# EAGLE design dnc_titreur (EAGLE 7.1.0)
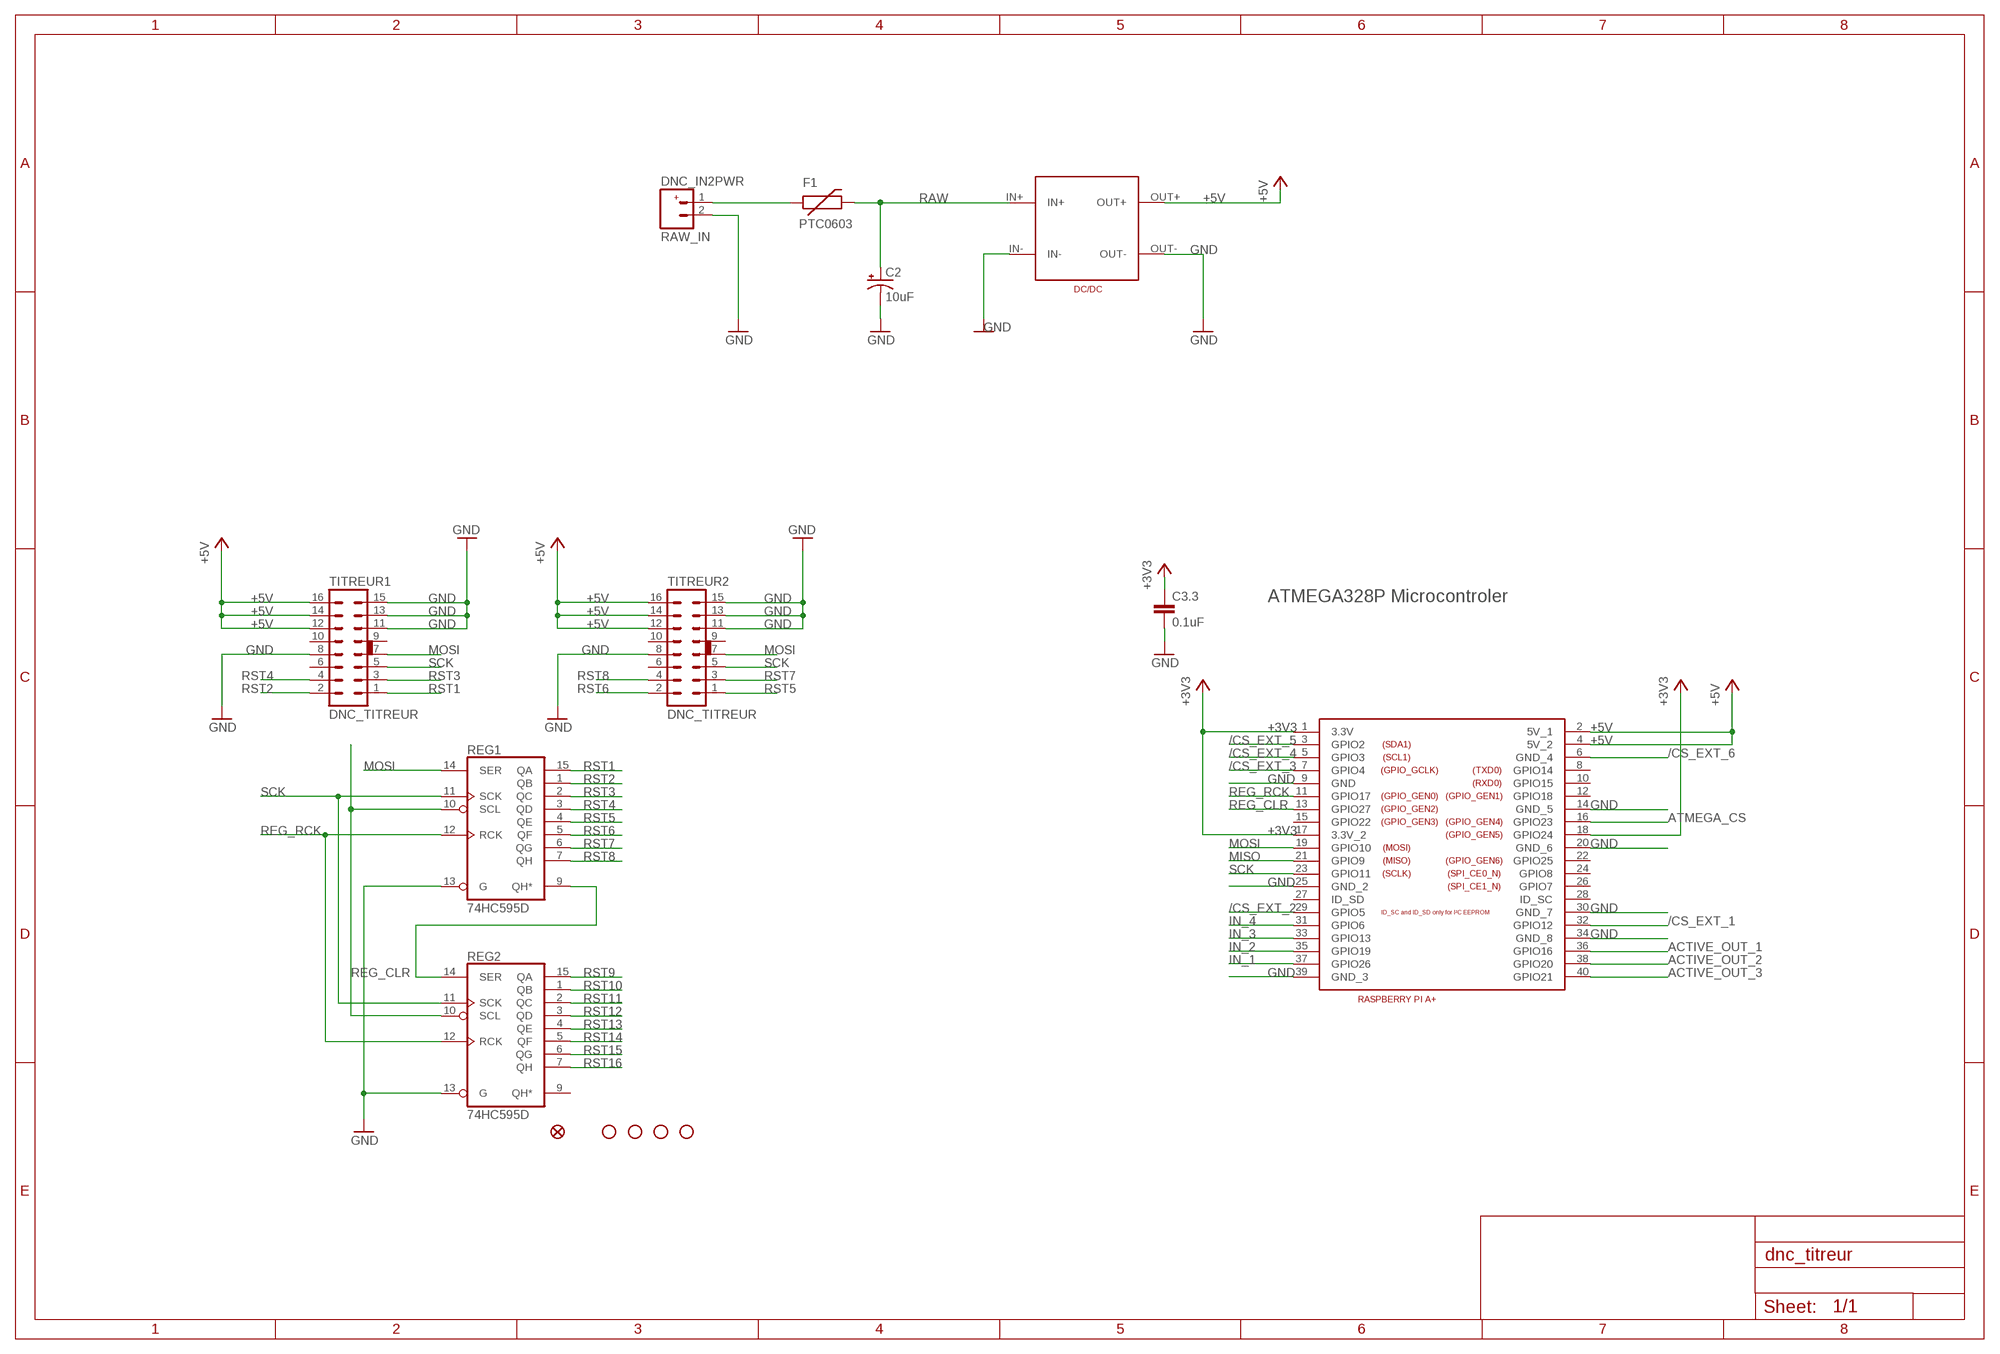
[diagram p0: schematic, sheet 1]

## Parts
C2  10uF  CAP_POL1206  [EIA3216]
C3.3  0.1uF  C-EUC0805  [C0805]
F1  PTC0603  [0603]
JP14  FIDUCIAL1X2.5  [FIDUCIAL-1X2.5]
JP15  STAND-OFF  [STAND-OFF]
JP16  STAND-OFF  [STAND-OFF]
JP17  STAND-OFF  [STAND-OFF]
JP18  STAND-OFF  [STAND-OFF]
RAW_IN  DNC_IN2PWR  [DNC_IN2_PWR]
REG1  74HC595D  [SO16]
REG2  74HC595D  [SO16]
TITREUR1  DNC_TITREUR  [DNC_TITREUR]
TITREUR2  DNC_TITREUR  [DNC_TITREUR]
U$4  RASPIA+  [RASPIA+]
U$5  DC/DC_SEED  [DC/DC_SEED]

## Nets
+3V3: C3.3.1 U$4.1(3.3V) U$4.17(3.3V_2) U$4.18(GPIO24)
+5V: TITREUR1.12 TITREUR1.14 TITREUR1.16 TITREUR2.12 TITREUR2.14 TITREUR2.16 U$4.2(5V_1) U$4.4(5V_2) U$5.OUT+
/CS_EXT_1: U$4.32(GPIO12)
/CS_EXT_2: U$4.29(GPIO5)
/CS_EXT_3: U$4.7(GPIO4)
/CS_EXT_4: U$4.5(GPIO3)
/CS_EXT_5: U$4.3(GPIO2)
/CS_EXT_6: U$4.6(GND_4)
ACTIVE_OUT_1: U$4.36(GPIO16)
ACTIVE_OUT_2: U$4.38(GPIO20)
ACTIVE_OUT_3: U$4.40(GPIO21)
ATMEGA_CS: U$4.16(GPIO23)
GND: C2.C(-) C3.3.2 RAW_IN.2 REG1.13(G) REG2.13(G) TITREUR1.8 TITREUR1.11 TITREUR1.13 TITREUR1.15 TITREUR2.8 TITREUR2.11 TITREUR2.13 TITREUR2.15 U$4.9(GND) U$4.14(GND_5) U$4.20(GND_6) U$4.25(GND_2) U$4.30(GND_7) U$4.34(GND_8) U$4.39(GND_3) U$5.IN- U$5.OUT-
IN_1: U$4.37(GPIO26)
IN_2: U$4.35(GPIO19)
IN_3: U$4.33(GPIO13)
IN_4: U$4.31(GPIO6)
MISO: U$4.21(GPIO9)
MOSI: REG1.14(SER) TITREUR1.7 TITREUR2.7 U$4.19(GPIO10)
N$7: REG1.9(QH*) REG2.14(SER)
N$12: F1.1 RAW_IN.1
RAW: C2.A(+) F1.2 U$5.IN+
REG_CLR: REG1.10(SCL) REG2.10(SCL) U$4.13(GPIO27)
REG_RCK: REG1.12(RCK) REG2.12(RCK) U$4.11(GPIO17)
RST1: REG1.15(QA) TITREUR1.1
RST2: REG1.1(QB) TITREUR1.2
RST3: REG1.2(QC) TITREUR1.3
RST4: REG1.3(QD) TITREUR1.4
RST5: REG1.4(QE) TITREUR2.1
RST6: REG1.5(QF) TITREUR2.2
RST7: REG1.6(QG) TITREUR2.3
RST8: REG1.7(QH) TITREUR2.4
RST9: REG2.15(QA)
RST10: REG2.1(QB)
RST11: REG2.2(QC)
RST12: REG2.3(QD)
RST13: REG2.4(QE)
RST14: REG2.5(QF)
RST15: REG2.6(QG)
RST16: REG2.7(QH)
SCK: REG1.11(SCK) REG2.11(SCK) TITREUR1.5 TITREUR2.5 U$4.23(GPIO11)
Unconnected: REG2.9(QH*) TITREUR1.6 TITREUR1.9 TITREUR1.10 TITREUR2.6 TITREUR2.9 TITREUR2.10 U$4.8(GPIO14) U$4.10(GPIO15) U$4.12(GPIO18) U$4.15(GPIO22) U$4.22(GPIO25) U$4.24(GPIO8) U$4.26(GPIO7) U$4.27(ID_SD) U$4.28(ID_SC)

## Notes on the sheet
- ATMEGA328P Microcontroler

## Power pins joined to a net without a drawn wire
GND: REG1.8(GND) REG2.8(GND)
VCC: REG1.16(VCC) REG2.16(VCC)

## Library data of the parts
C2 = SparkFun:CAP_POL: Capacitor Polarized These are standard SMD and PTH capacitors. Normally 10uF, 47uF, and 100uF in electrolytic and tantalum varieties. Always verify the external diameter of the through hole cap, it varies with capacity, voltage, and manufacturer. The EIA devices should be standard.
C3.3 = rcl:C-EU: CAPACITOR, European symbol
F1 = SparkFun-PowerIC:PTC: Resettable Fuse PTC Resettable Fuse. Spark Fun Electronics SKU : COM-08357
JP14 = SparkFun:FIDUCIAL: Fiducial Alignment Points Various fiducial points for machine vision alignment.
JP15-JP18 = SparkFun:STAND-OFF: Stand Off This is the mechanical footprint for a #4 phillips button head screw. Use the keepout ring to avoid running the screw head into surrounding components. SKU : PRT-00447
RAW_IN = pierre_vv:DNC_IN2
REG1 REG2 = 74xx-eu:74*595: 8-bit SHIFT REGISTER, output latch
TITREUR1 TITREUR2 = pierre_vv:DNC_TITREUR
U$4 = pierre_vv:RASPIA+
U$5 = pierre_vv:DC/DC_SEED

## Net classes
0 default: width 0.203 mm
1 GND: width 0.254 mm
2 3.3V: width 0.254 mm

## Board
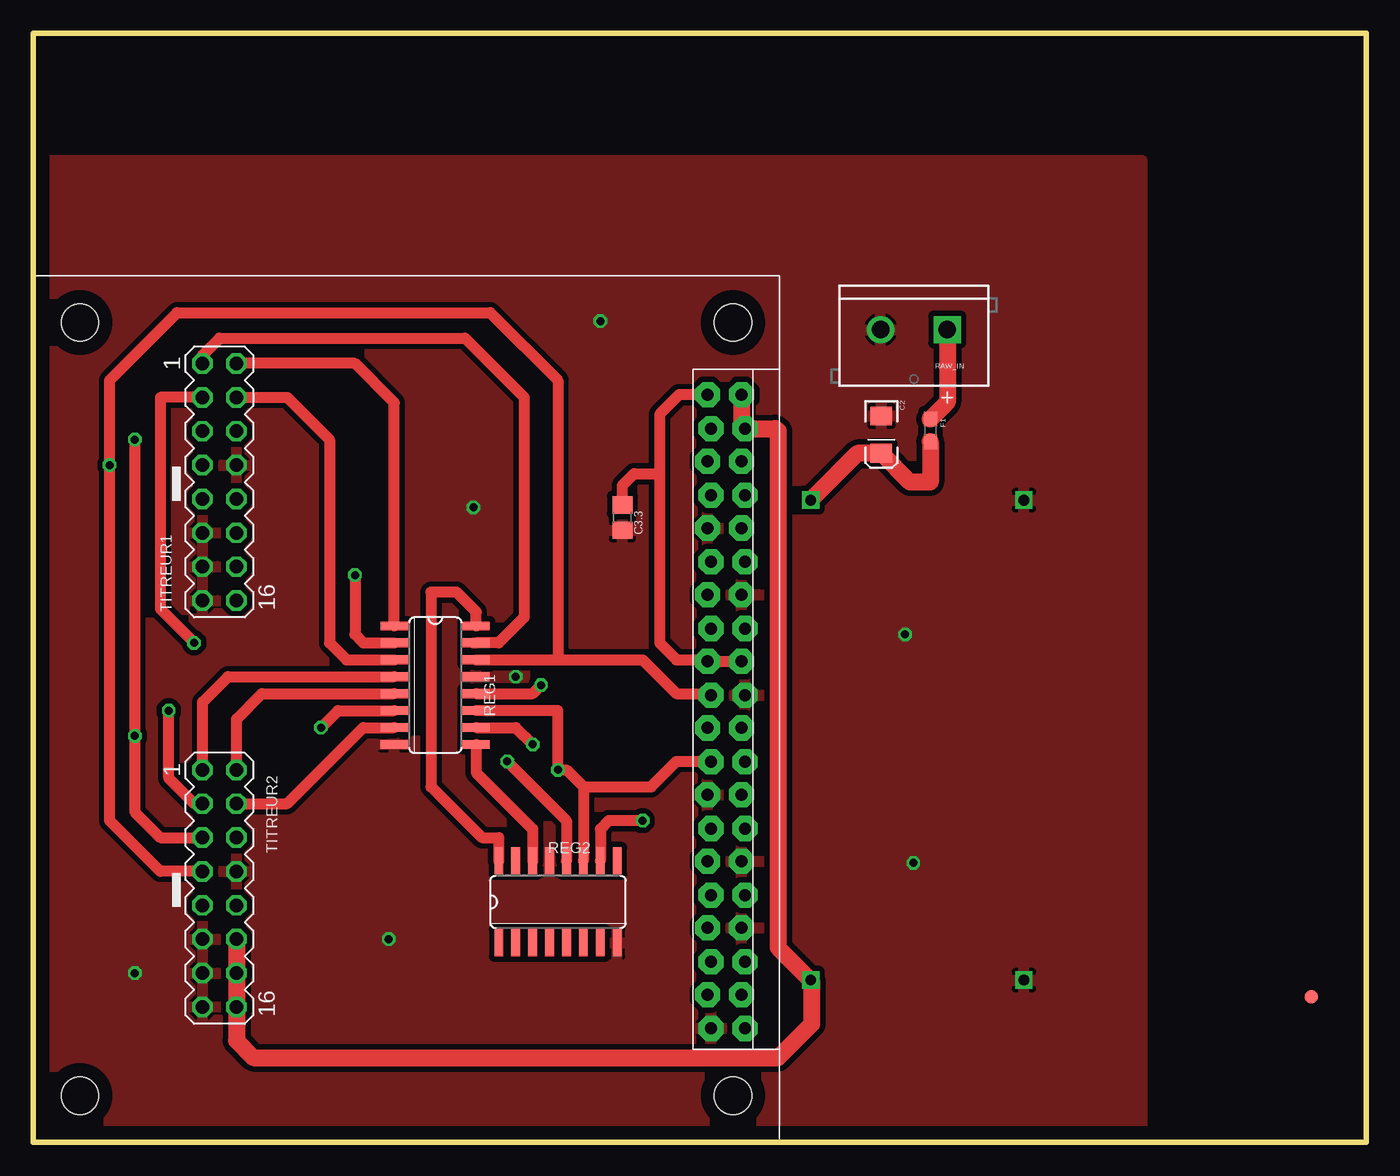
[diagram p1: board, top side]
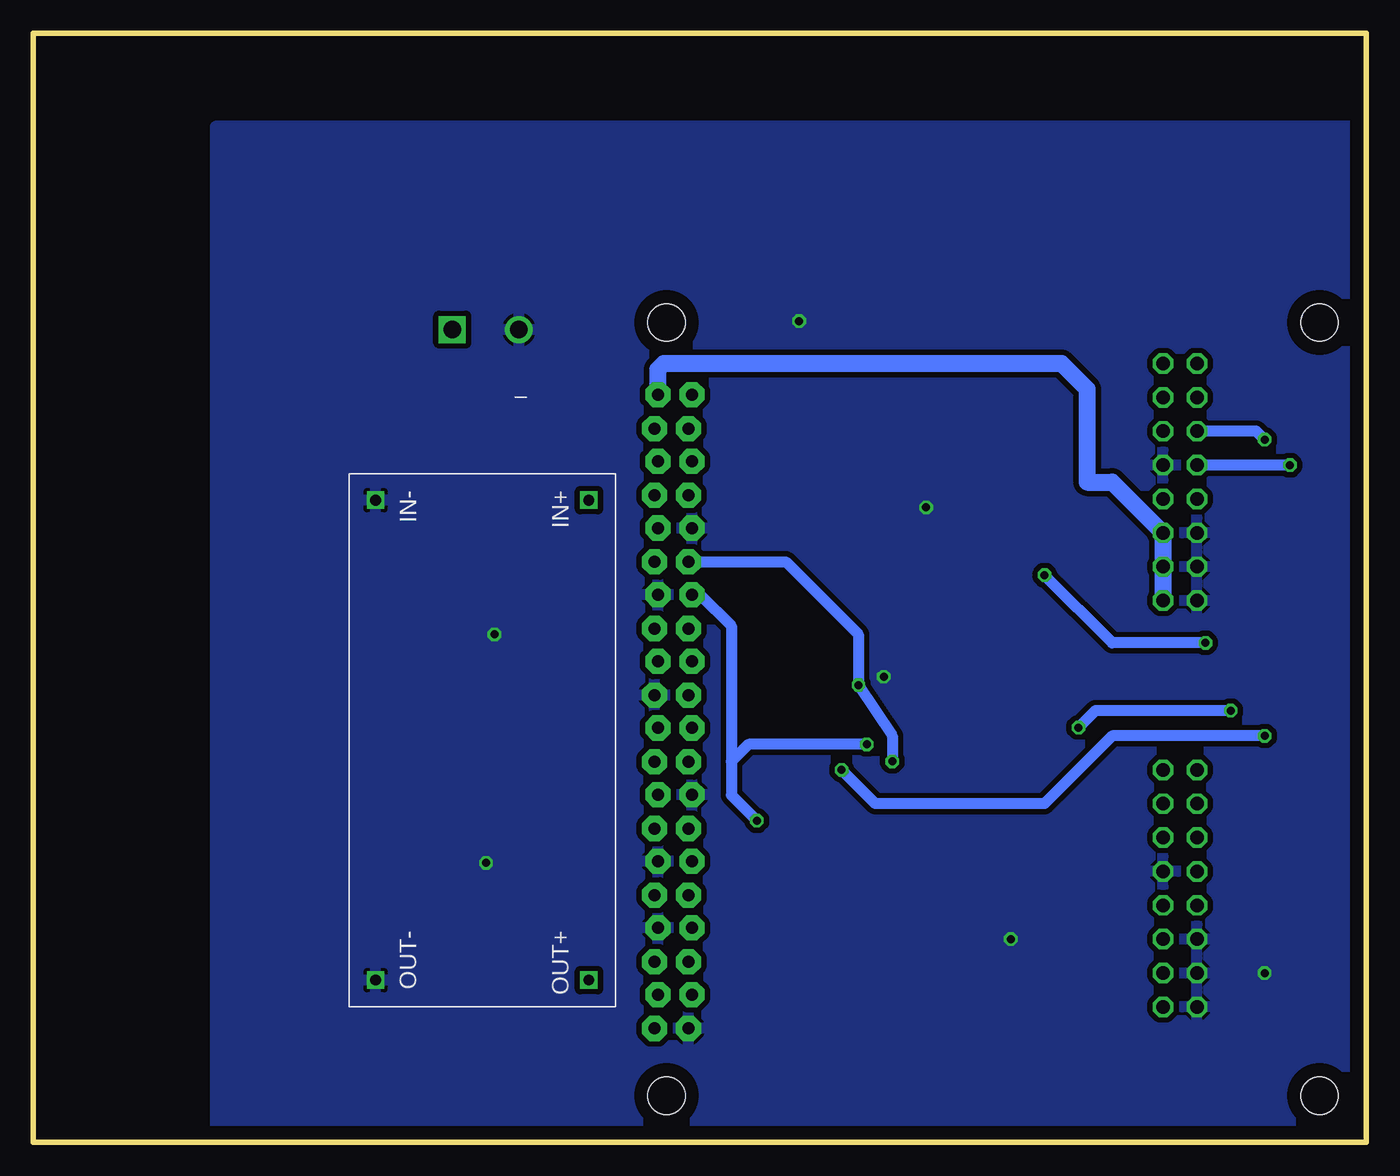
[diagram p2: board, bottom side, seen from below]

Size 100.01 x 83.19 mm. Coordinates in mm from the lower left corner, seen from the top.
Outline: 100,0 0,0 0,83.19 100.01,83.19 100.01,0
Copper layers (1*16): Top 0.035mm / dielectric 1.5mm / Bottom 0.035mm
Design rules "default *": minimum track width 10mil, minimum drill 24mil, track to track 16mil, track to pad 16mil, pad to pad 16mil, via to via 16mil, smd to smd 16mil, copper to edge 40mil, drill to drill 8mil, minimum pad ring 10mil, minimum via ring 8mil, stop-mask expansion 4mil, vias tented up to drill 0mil, thermal gap 10mil

### Footprints (pad centres in the part's own frame; a part is rotated, then mirrored left to right if it is on the bottom)
EIA3216 = smd 1.4 x 1.6: A 1.4,0; C -1.4,0
C0805 = smd 1.3 x 1.5: 1 -0.95,0; 2 0.95,0
0603 = smd 1.1 x 1: 1 -0.85,0; 2 0.85,0
FIDUCIAL-1X2.5 = smd 1 x 1: 1 0,0
STAND-OFF = hole 3.302: 0,0
DNC_IN2_PWR = drill 1.3 pad 2.032 square: 1 0,0 | drill 1.3 pad 2.032: 2 5,0
SO16 = smd 0.66 x 2.032: 1 -4.445,-3.073; 2 -3.175,-3.073; 3 -1.905,-3.073; 4 -0.635,-3.073; 5 0.635,-3.073; 6 1.905,-3.073; 7 3.175,-3.073; 8 4.445,-3.073; 9 4.445,3.073; 10 3.175,3.073; 11 1.905,3.073; 12 0.635,3.073; 13 -0.635,3.073; 14 -1.905,3.073; 15 -3.175,3.073; 16 -4.445,3.073
DNC_TITREUR = drill 1.016 octagon: 1 -8.89,-1.27; 2 -8.89,1.27; 3 -6.35,-1.27; 4 -6.35,1.27; 5 -3.81,-1.27; 6 -3.81,1.27; 7 -1.27,-1.27; 8 -1.27,1.27; 9 1.27,-1.27; 10 1.27,1.27; 11 3.81,-1.27; 12 3.81,1.27; 13 6.35,-1.27; 14 6.35,1.27; 15 8.89,-1.27; 16 8.89,1.27
RASPIA+ = drill 0.9 pad 1.88 octagon: 1 -50.603,-56.08; 2 -53.143,-56.08; 3 -50.857,-53.54; 4 -53.397,-53.54; 5 -50.603,-51.08; 6 -53.143,-51.08; 7 -50.857,-48.54; 8 -53.397,-48.54; 9 -50.603,-46.08; 10 -53.143,-46.08; 11 -50.857,-43.54; 12 -53.397,-43.54; 13 -50.603,-41.08; 14 -53.143,-41.08; 15 -50.857,-38.54; 16 -53.397,-38.54; 17 -50.603,-36.08; 18 -53.143,-36.08; 19 -50.857,-33.54; 20 -53.397,-33.54; 21 -50.603,-31.08; 22 -53.143,-31.08; 23 -50.857,-28.54; 24 -53.397,-28.54; 25 -50.603,-26.08; 26 -53.143,-26.08; 27 -50.857,-23.54; 28 -53.397,-23.54; 29 -50.603,-21.08; 30 -53.143,-21.08; 31 -50.857,-18.54; 32 -53.397,-18.54; 33 -50.603,-16.08; 34 -53.143,-16.08; 35 -50.857,-13.54; 36 -53.397,-13.54; 37 -50.603,-11.08; 38 -53.143,-11.08; 39 -50.857,-8.54; 40 -53.397,-8.54 | hole 2.8: -52.5,-3.5; -3.5,-3.5; -3.5,-61.5; -52.5,-61.5
DC/DC_SEED = drill 0.8 square: IN+ -2,18; IN- -2,2; OUT+ -38,18; OUT- -38,2

### Placement (x,y rotation side)
C2  63.63,53.09 270 top
C3.3  44.2,46.86 270 top
F1  67.31,53.4 270 top
JP14  95.89,10.92 0 top
JP15  -87.63,132.08 0 top  (outside the outline)
JP16  -93.98,132.08 0 top  (outside the outline)
JP17  -100.33,132.08 0 top  (outside the outline)
JP18  -106.68,132.08 0 top  (outside the outline)
RAW_IN  68.58,60.96 180 top
REG1  30.16,34.29 270 top
REG2  39.37,18.03 0 top
TITREUR1  13.97,49.53 270 top
TITREUR2  13.97,19.05 270 top
U$4  0,0 180 top
U$5  76.33,50.16 90 top

### Tracks (layer width: path | path; a pad name or v marks a point on that pad's centre or on a via)
+3V3
  Top 0.813: U$4.1 48.46,56.08 46.99,54.61 46.99,50.16 | 46.99,50.16 46.99,37.47 48.26,36.2 50.49,36.2 U$4.17 U$4.18 | C3.3.1 44.2,49.28 45.09,50.16 46.99,50.16
+5V
  Top 1.27: U$4.2 53.14,53.79 U$4.4 55.68,53.54 55.88,53.34 55.88,14.61 U$5.OUT+ 58.42,12.07 58.42,8.89 55.88,6.35 16.51,6.35 15.24,7.62 TITREUR2.16 TITREUR2.14 TITREUR2.12
  Bottom 1.27: U$4.2 53.14,57.98 52.7,58.42 22.86,58.42 20.95,56.52 20.95,49.53 19.05,49.53 TITREUR1.12 TITREUR1.14 TITREUR1.16
GND  (via drill 0.6)
  other vias: 33.02,47.62 65.41,38.1 26.67,15.24 36.2,34.92 7.62,12.7 42.55,61.59 66.04,20.95
  pour Bottom: -9.53,76.2 86.36,76.2 86.36,-10.16 -9.53,-10.16
  pour Top: -6.99,73.66 83.19,73.66 83.19,-6.35 -6.99,-6.35
MOSI  (via drill 0.6)
  Top 0.813: TITREUR2.7 9.53,20.32 5.71,24.13 v5.71,50.8 5.71,57.15 10.79,62.23 34.29,62.23 39.37,57.15 39.37,36.2 | REG1.14 39.37,36.2 | 39.37,36.2 45.72,36.2 48.26,33.66 50.74,33.66 U$4.19
  Bottom 0.813: v5.71,50.8 TITREUR1.7
N$7
  Top 0.813: REG1.9 33.24,27.72 37.47,23.5 REG2.14
N$12
  Top 1.27: RAW_IN.1 68.58,55.52 F1.1
RAW
  Top 1.27: F1.2 67.31,49.53 65.78,49.53 C2.A 61.85,51.69 U$5.IN+
REG_CLR  (via drill 0.6)
  Top 0.813: v45.72,24.13 43.18,24.13 42.55,23.5 REG2.10 | REG1.10 36.2,31.11 v37.47,29.84
  Bottom 0.813: U$4.13 49.97,41.08 47.62,38.73 47.62,28.57 | 47.62,28.57 47.62,26.04 v45.72,24.13 | v37.47,29.84 46.35,29.84 47.62,28.57
REG_RCK  (via drill 0.6)
  Top 0.813: REG1.12 37.47,33.66 v38.1,34.29 | v35.56,28.57 40.01,24.13 REG2.12
  Bottom 0.813: U$4.11 43.54,43.54 38.1,38.1 v38.1,34.29 35.56,30.48 v35.56,28.57
RST1
  Top 0.813: TITREUR1.1 12.7,59.05 13.97,60.33 32.38,60.33 36.83,55.88 36.83,39.37 34.92,37.47 REG1.15 33.02,37.47
RST2
  Top 0.813: REG1.1 27.09,55.46 24.13,58.42 TITREUR1.2
RST3  (via drill 0.6)
  Top 0.813: TITREUR1.3 9.53,55.88 9.53,40.01 v12.06,37.47 | v24.13,42.55 24.13,38.1 24.77,37.47 REG1.2
  Bottom 0.813: v12.06,37.47 19.05,37.47 v24.13,42.55
RST4
  Top 0.813: TITREUR1.4 19.05,55.88 22.23,52.7 22.23,37.47 23.5,36.2 REG1.3
RST5
  Top 0.813: TITREUR2.1 12.7,33.02 14.61,34.92 REG1.4
RST6
  Top 0.813: TITREUR2.2 15.24,31.75 17.14,33.66 REG1.5
RST7  (via drill 0.6)
  Top 0.813: TITREUR2.3 12.06,25.4 10.16,27.3 v10.16,32.38 | v21.59,31.11 22.86,32.38 REG1.6
  Bottom 0.813: v10.16,32.38 20.32,32.38 v21.59,31.11
RST8
  Top 0.813: TITREUR2.4 19.05,25.4 24.77,31.11 REG1.7
SCK  (via drill 0.6)
  Top 0.813: v7.62,52.7 v7.62,30.48 7.62,24.77 9.53,22.86 TITREUR2.5 | REG1.11 39.37,32.38 v39.37,27.94 40.01,27.94 41.27,26.67 | 41.27,26.67 REG2.11 | 41.27,26.67 46.35,26.67 48.26,28.57 50.82,28.57 U$4.23
  Bottom 0.813: v7.62,30.48 19.05,30.48 24.13,25.4 36.83,25.4 v39.37,27.94 | v7.62,52.7 8.26,53.34 TITREUR1.5
VCC
  Top 0.813: REG1.16 33.24,39.79 31.75,41.27 29.84,41.27 29.84,26.67 33.66,22.86 34.92,22.86 REG2.16